# EAGLE design EMGrealPart (EAGLE 9.3.1)

## Sheet 1 of 2
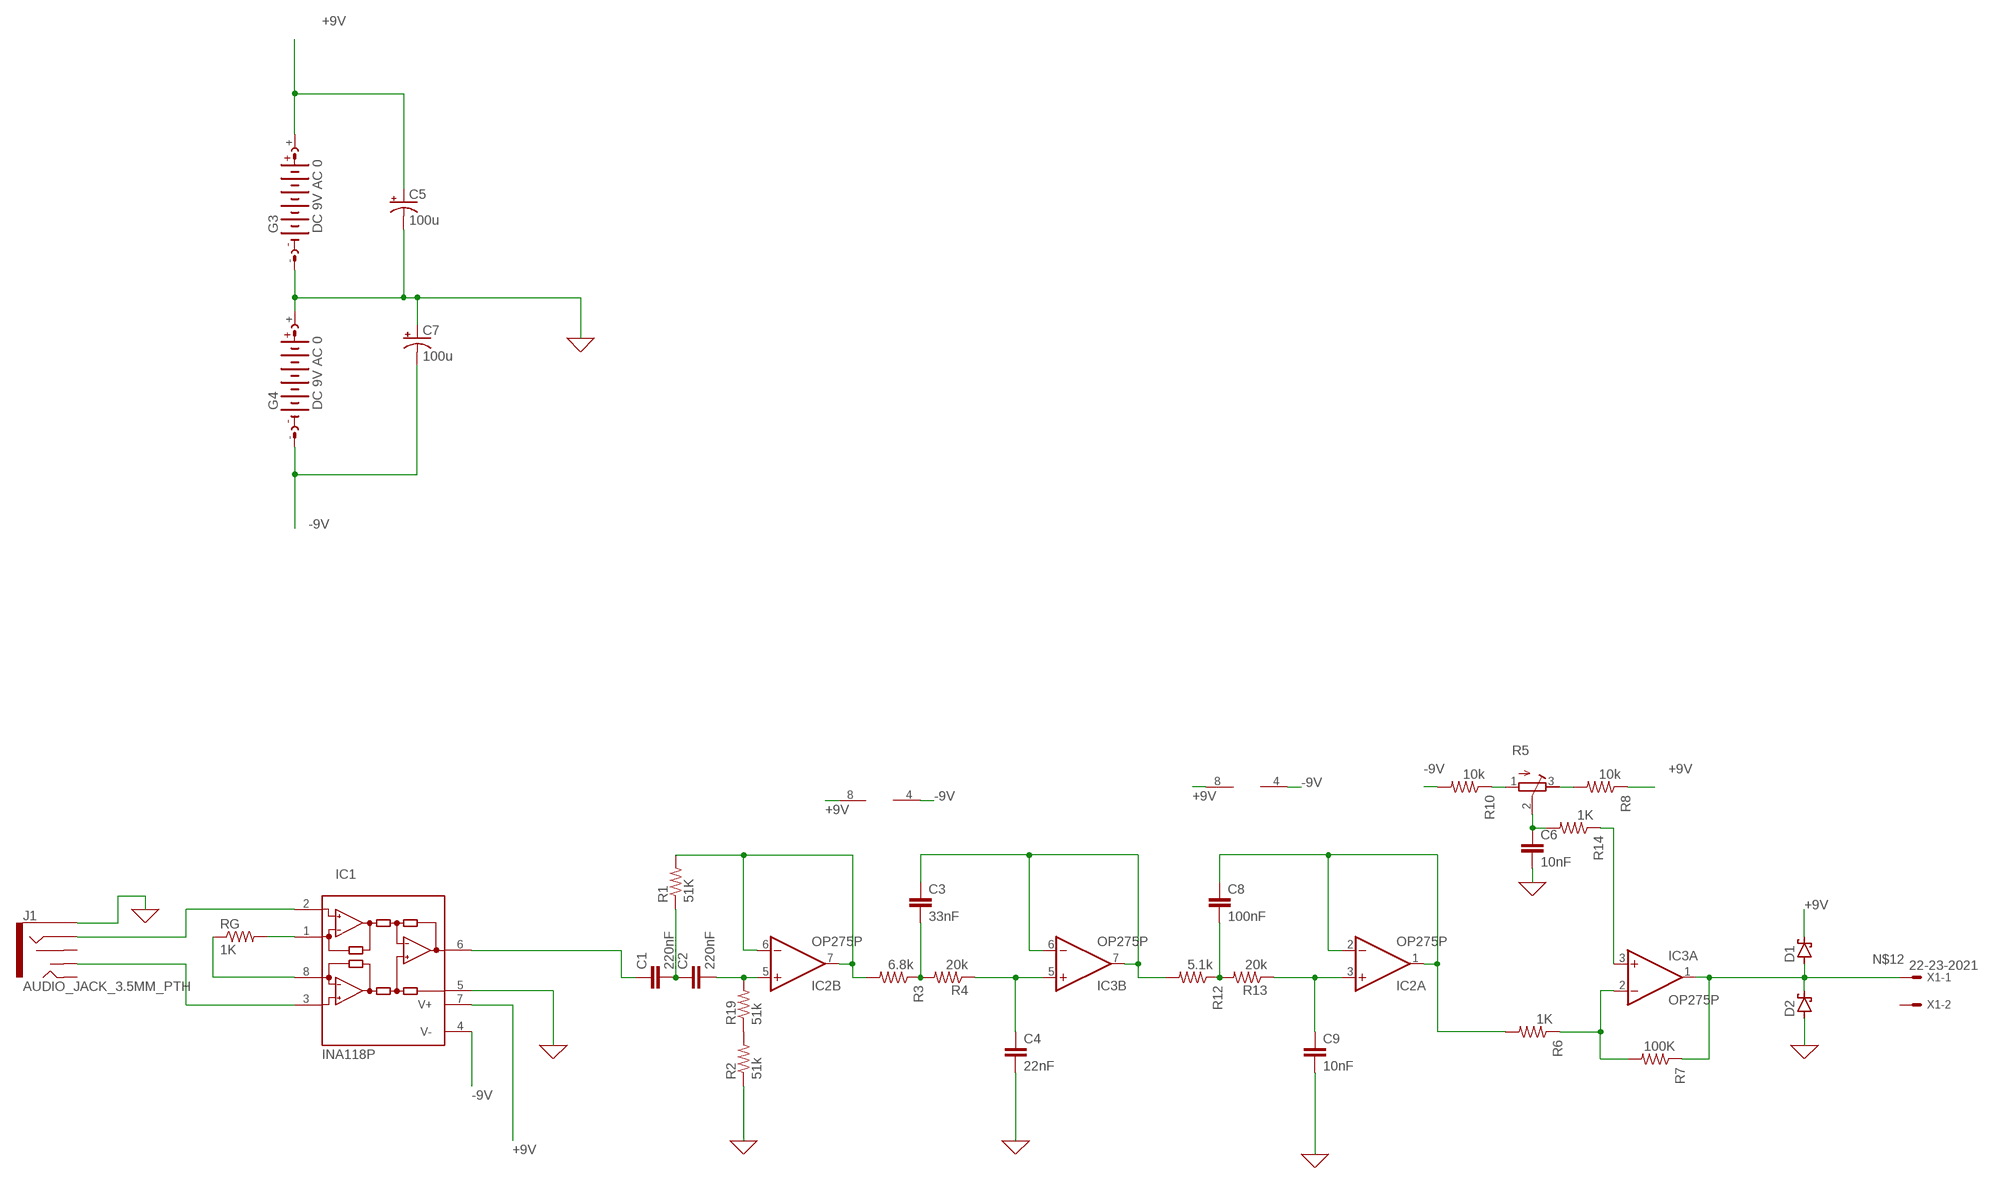
[diagram p0: schematic, sheet 1]

### Parts
C1  220nF  C-EU050-025X075  [C050-025X075]
C2  220nF  C-EU050-025X075  [C050-025X075]
C3  33nF  C-EU050-025X075  [C050-025X075]
C4  22nF  C-EU050-025X075  [C050-025X075]
C5  100u  CPOL-USE2.5-6  [E2,5-6]
C6  10nF  C-EU050-025X075  [C050-025X075]
C7  100u  CPOL-USE2.5-6  [E2,5-6]
C8  100nF  C-EU050-025X075  [C050-025X075]
C9  10nF  C-EU050-025X075  [C050-025X075]
D1  SCHOTTKY-DIODEF126Z12  [F126Z12]
D2  SCHOTTKY-DIODEF126Z12  [F126Z12]
G3  DC 9V AC 0  AB9V  [AB9V]
G4  DC 9V AC 0  AB9V  [AB9V]
IC1  INA118P  [DIL08]
IC2  OP275P  [DIL08]
IC3  OP275P  [DIL08]
J1  AUDIO_JACK_3.5MM_PTH  [AUDIO-JACK]
R1  51K  R-US_0207/12  [0207/12]
R2  51k  R-US_0207/12  [0207/12]
R3  6.8k  R-US_0207/12  [0207/12]
R4  20k  R-US_0207/12  [0207/12]
R5  R-TRIMM64W  [RTRIM64W]
R6  1K  R-US_0207/12  [0207/12]
R7  100K  R-US_0207/12  [0207/12]
R8  10k  R-US_0207/12  [0207/12]
R10  10k  R-US_0207/12  [0207/12]
R12  5.1k  R-US_0207/12  [0207/12]
R13  20k  R-US_0207/12  [0207/12]
R14  1K  R-US_0207/12  [0207/12]
R19  51k  R-US_0207/12  [0207/12]
RG  1K  R-US_0207/12  [0207/12]
X1  22-23-2021  [22-23-2021]

### Nets
0: C4.2 C5.- C6.2 C7.+ C9.2 D2.A G3.- G4.+ IC1.5(REF) J1.SLEEVE R2.1 ; supply symbol labelled GND
+9V: C5.+ D1.C G3.+ IC1.7(V+) IC2.8(P:V+) IC3.8(P:V+) R8.1
-9V: C7.- G4.- IC1.4(V-) IC2.4(P:V-) IC3.4(P:V-) R10.2
N$1: IC1.1(RG) RG.2
N$2: IC1.8(RG) RG.1
N$3: IC1.2(-IN) J1.RING
N$4: C8.2 R12.1 R13.2
N$5: C1.2 C2.1 R1.1
N$6: C1.1 IC1.6(OUT)
N$7: C2.2 IC2.5(B:+IN) R19.2
N$8: IC2.6(B:-IN) IC2.7(B:OUT) R1.2 R3.2
N$9: C3.2 R3.1 R4.2
N$10: C4.1 IC3.5(B:+IN) R4.1
N$11: C3.1 IC3.6(B:-IN) IC3.7(B:OUT) R12.2
N$12: D1.A D2.C IC3.1(A:OUT) R7.1 X1.1
N$14: C9.1 IC2.3(A:+IN) R13.1
N$15: R5.1(A) R10.1
N$16: C6.1 R5.2(S) R14.2
N$17: IC3.2(A:-IN) R6.1 R7.2
N$18: R2.2 R19.1
N$19: C8.1 IC2.1(A:OUT) IC2.2(A:-IN) R6.2
N$20: R5.3(E) R8.2
N$25: IC3.3(A:+IN) R14.1
N$26: IC1.3(+IN) J1.TSH
Unconnected: J1.RSH J1.TIP X1.2

## Sheet 2 of 2
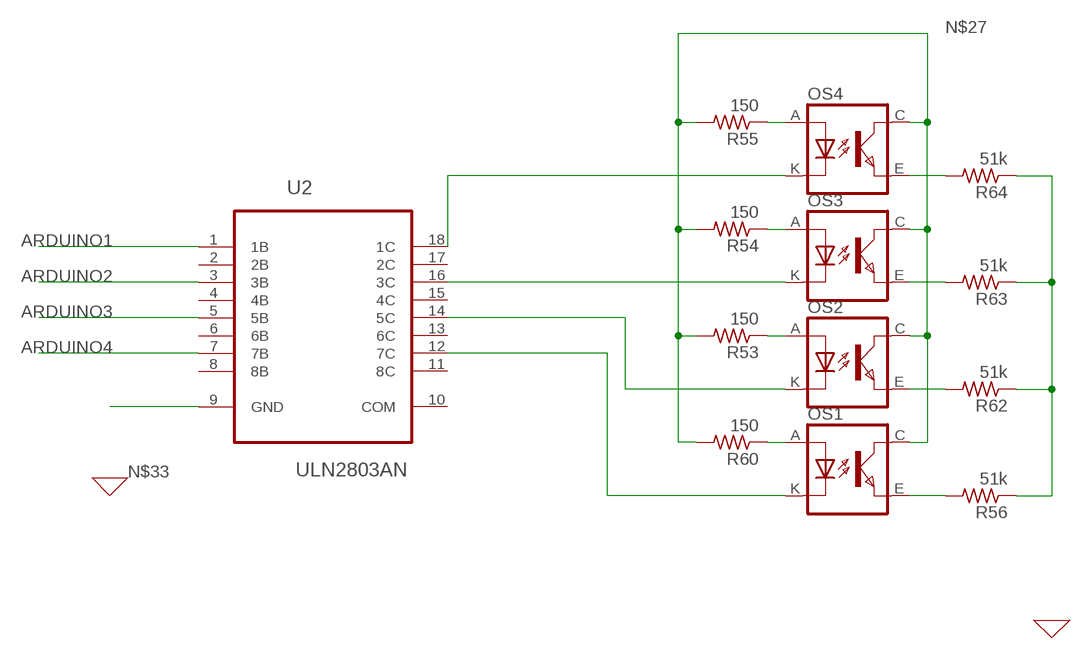
[diagram p1: schematic, sheet 2]

### Parts
OS1  TCRT5000  [TCRT5000]
OS2  TCRT5000  [TCRT5000]
OS3  TCRT5000  [TCRT5000]
OS4  TCRT5000  [TCRT5000]
R53  150  R-US_0207/12  [0207/12]
R54  150  R-US_0207/12  [0207/12]
R55  150  R-US_0207/12  [0207/12]
R56  51k  R-US_0207/12  [0207/12]
R60  150  R-US_0207/12  [0207/12]
R62  51k  R-US_0207/12  [0207/12]
R63  51k  R-US_0207/12  [0207/12]
R64  51k  R-US_0207/12  [0207/12]
U2  ULN2803AN  [DIP254P762X393-18]

### Nets
ARDUINO1: U2.1(1B)
ARDUINO2: U2.3(3B)
ARDUINO3: U2.5(5B)
ARDUINO4: U2.7(7B)
N$21: OS4.K(CATHODE) U2.18(1C)
N$22: OS3.K(CATHODE) U2.16(3C)
N$23: OS2.K(CATHODE) U2.14(5C)
N$24: OS1.K(CATHODE) U2.12(7C)
N$27: OS1.C(COLLECTOR) OS2.C(COLLECTOR) OS3.C(COLLECTOR) OS4.C(COLLECTOR) R53.2 R54.2 R55.2 R60.2
N$28: R56.1 R62.1 R63.1 R64.1
N$33: U2.9(GND)
N$94: OS1.E(EMITTER) R56.2
N$95: OS2.E(EMITTER) R62.2
N$96: OS3.E(EMITTER) R63.2
N$97: OS4.E(EMITTER) R64.2
N$98: OS4.A(ANODE) R55.1
N$99: OS3.A(ANODE) R54.1
N$100: OS2.A(ANODE) R53.1
N$101: OS1.A(ANODE) R60.1
Unconnected: U2.2(2B) U2.4(4B) U2.6(6B) U2.8(8B) U2.10(COM) U2.11(8C) U2.13(6C) U2.15(4C) U2.17(2C)

## Library data of the parts
C1-C4 C6 C8 C9 = rcl:C-EU: CAPACITOR, European symbol; SPICEPREFIX: C
C5 C7 = rcl:CPOL-US: POLARIZED CAPACITOR, American symbol; SPICEPREFIX: C
D1 D2 = diode:SCHOTTKY-DIODE: Schottky Diode
G3 G4 = battery:AB9V: 9-V BATTERY CLIP; SPICEPREFIX: V
IC1 = burr-brown:INA118: Instrumentation Amplifier Precision, Low Power; MF: TEXAS INSTRUMENTS; MPN: INA118P; OC_FARNELL: 1470354; OC_NEWARK: 96K4515; SPICEMODEL: INA118a; SPICEPREFIX: X
IC2 IC3 = linear:OP275: Dual Very Low Noise Precision Operational Amplifier Source: http://www.analog.com/static/imported-files/data_sheets/OP270.pdf; SPICEMODEL: OP275p; SPICEPREFIX: X
J1 = SparkFun-Connectors:AUDIO_JACK_3.5MM: Audio Jack 3.5mm variants of PTH and SMT stereo audio jack with bypass switches. SparkFun Products: SparkFun SparkPunk Sound Kit <[https://www.sparkfun.com/products/11177]> - PTH MP3 Trigger <https://www.sparkfun.com/products/13720> -3.5mm SMD SparkFun PicoBoard <https://www.sparkfun.com/products/11888>- 2.5mm SMD; PROD_ID: CONN-08774; SF_ID: PRT-08032
OS1-OS4 = tcrt5000:TCRT5000
R1-R4 R6-R8 R10 R12-R14 R19 R53-R56 R60 R62-R64 RG = rcl:R-US_: RESISTOR, American symbol; SPICEPREFIX: R
R5 = rcl:R-TRIMM: Trimm resistor; SPICEMODEL: X; SPICEPREFIXL: POT
U2 = transistor-arrays:ULN2803AN: Darlington transistor array; MPN: ULN2803AN; OC_FARNELL: 1652422; OC_NEWARK: 21J9298; PACKAGE: DIP-18; SUPPLIER: TEXAS INSTRUMENTS
X1 = con-molex:22-23-2021: .100" (2.54mm) Center Header - 2 Pin; MF: MOLEX; MPN: 22-23-2021; OC_FARNELL: 1462926; OC_NEWARK: 25C3832

## Module MO
Ports: OUT(io) IN(io)

### Library data of the parts

## Board
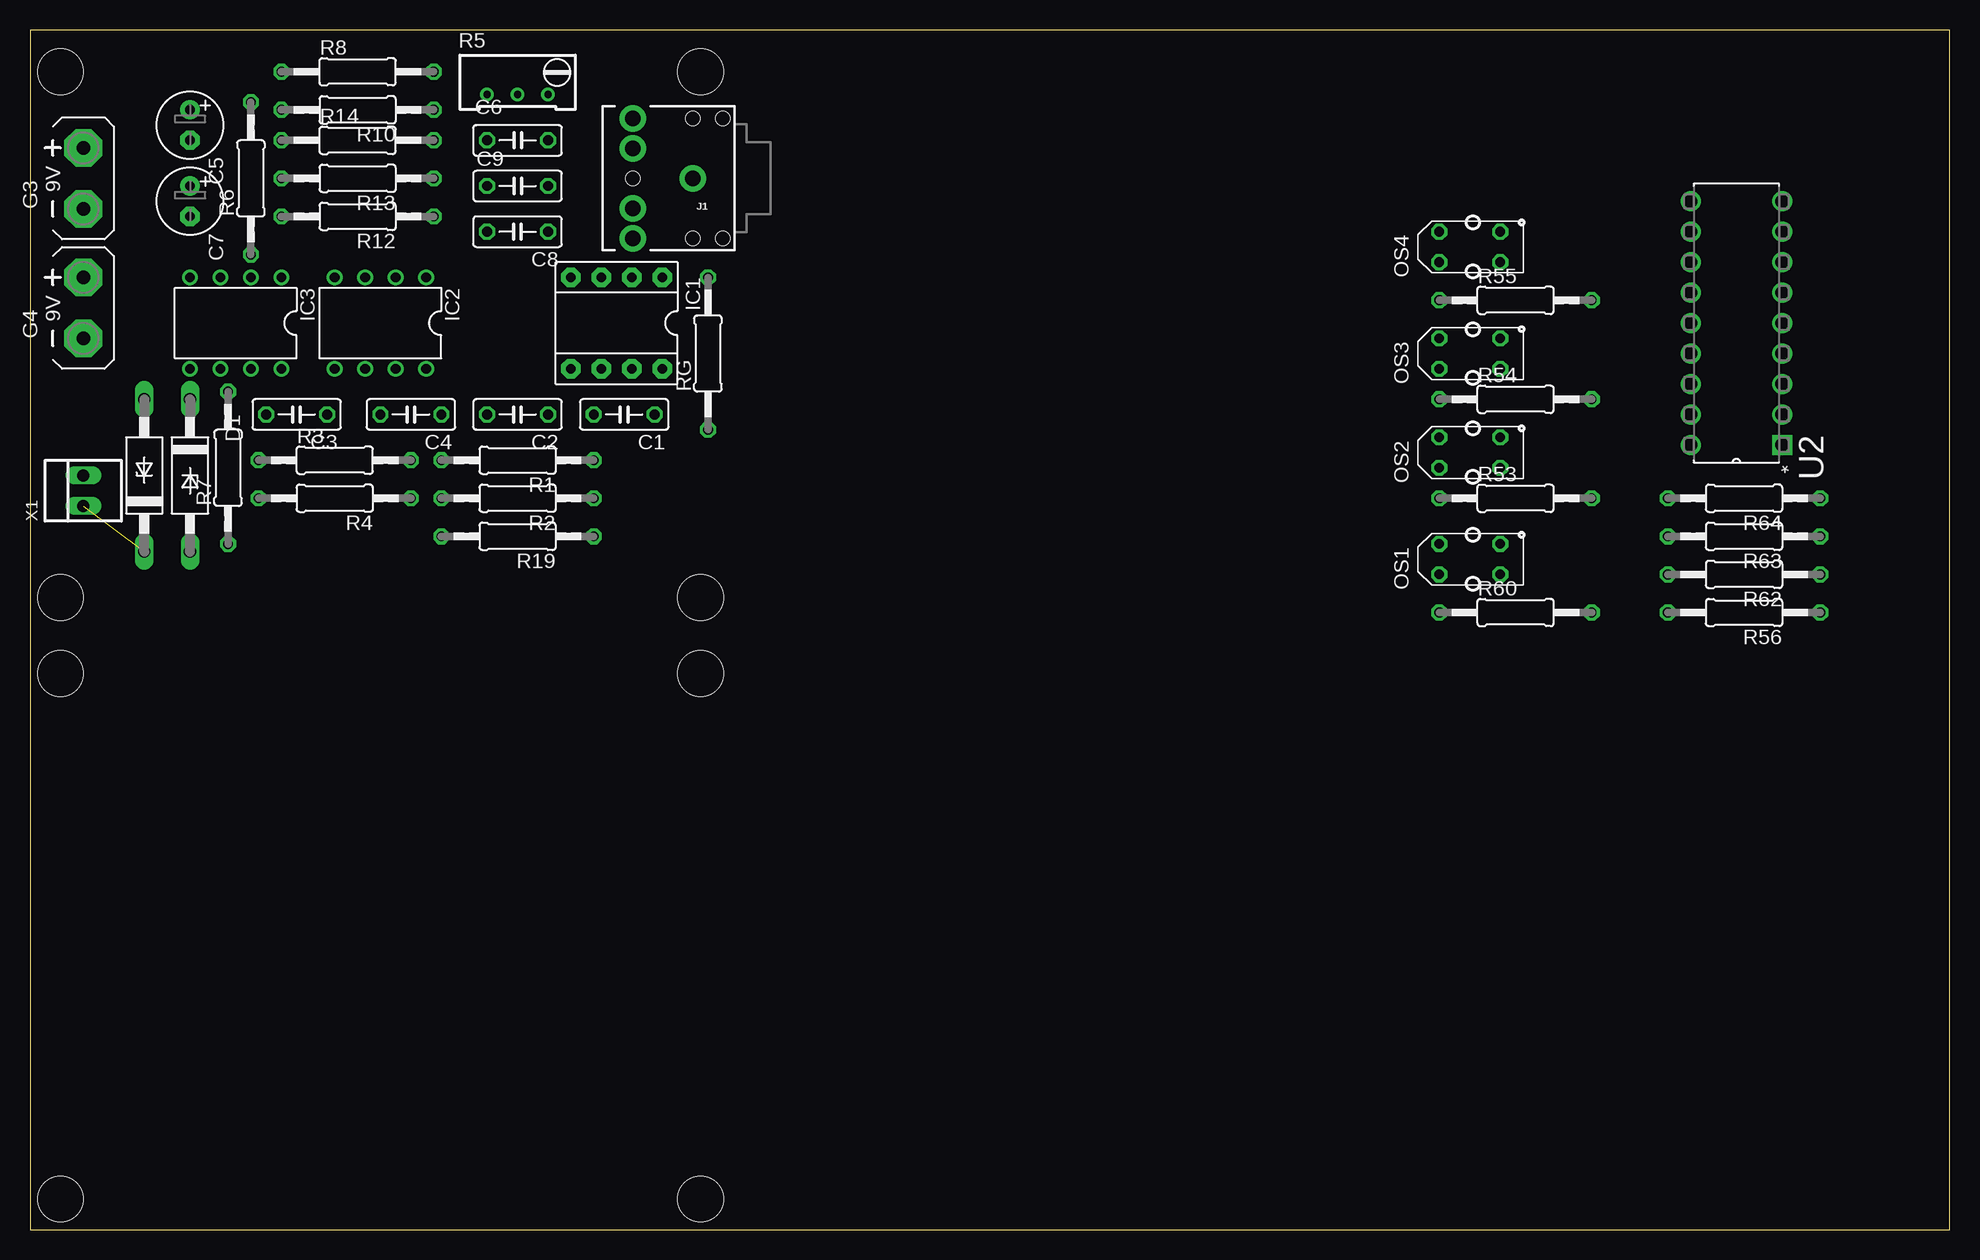
[diagram p2: board, top side]
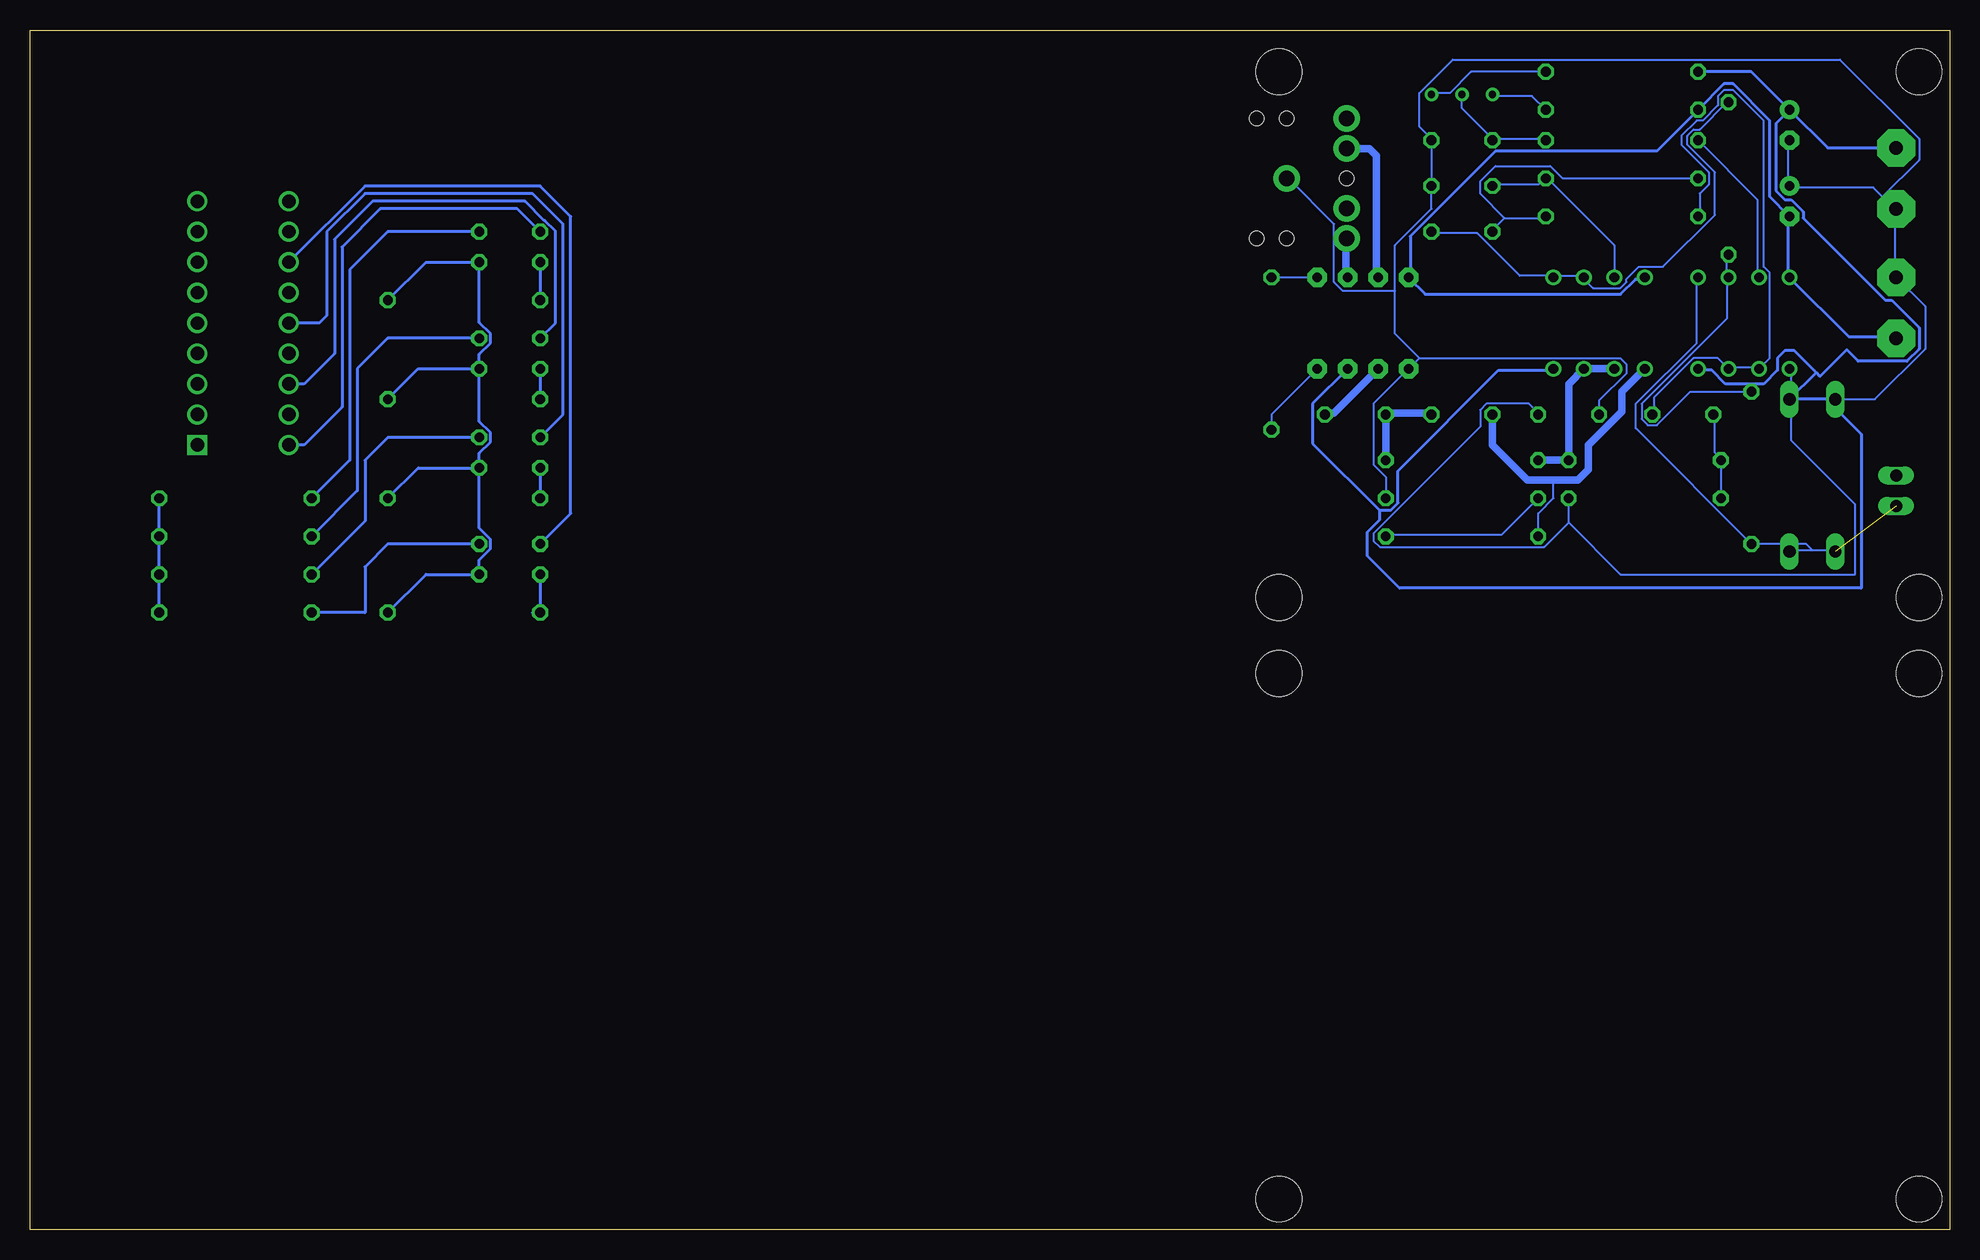
[diagram p3: board, bottom side, seen from below]

Size 160 x 100 mm. Coordinates in mm from the lower left corner, seen from the top.
Outline: 0,0 160,0 160,100 0,100 0,0
Copper layers (1*16): Top 0.035mm / dielectric 1.5mm / Bottom 0.035mm
Design rules "default": minimum track width 6mil, minimum drill 0.35mm, track to track 6mil, track to pad 6mil, pad to pad 6mil, via to via 6mil, smd to smd 6mil, copper to edge 40mil, drill to drill 6mil, minimum pad ring 10mil, minimum via ring 8mil, stop-mask expansion 4mil, vias tented up to drill 0mil, thermal gap 10mil
Holes 3.81 mm at 2.54,96.52 2.54,52.7 55.88,52.7 55.88,96.52 2.54,46.35 2.54,2.54 55.88,2.54 55.88,46.35

### Footprints (pad centres in the part's own frame; a part is rotated, then mirrored left to right if it is on the bottom)
C050-025X075 = drill 0.813 octagon: 1 -2.54,0; 2 2.54,0
E2,5-6 = drill 0.813 pad 1.6: + -1.27,0 | drill 0.813 pad 1.6 octagon: - 1.27,0
F126Z12 = drill 1.016 long: A 6.35,0; C -6.35,0
AB9V = drill 1.118 pad 3.15 octagon: + 0,2.54; - 0,-2.54
DIL08 = drill 0.813 pad 1.6 octagon: 1 -3.81,-3.81; 2 -1.27,-3.81; 3 1.27,-3.81; 4 3.81,-3.81; 5 3.81,3.81; 6 1.27,3.81; 7 -1.27,3.81; 8 -3.81,3.81
DIL08' = drill 0.813 pad 1.27: 1 -3.81,-3.81; 2 -1.27,-3.81; 3 1.27,-3.81; 4 3.81,-3.81; 5 3.81,3.81; 6 1.27,3.81; 7 -1.27,3.81; 8 -3.81,3.81
AUDIO-JACK = drill 1.3 pad 2.184: RING 5,5; RSH 5,2.5; SLEEVE 0,0; TIP 5,-5; TSH 5,-2.5 | hole 1.2: 0,5; -2.5,5; -2.5,-5; 0,-5; 5,0
TCRT5000 = drill 0.8 octagon: A -2.54,-1.27; C 2.54,-1.27; E 2.54,1.27; K -2.54,1.27
0207/12 = drill 0.813 octagon: 1 -6.35,0; 2 6.35,0
RTRIM64W = drill 0.61: 1 1.27,-2.54; 2 1.27,0; 3 1.27,2.54
DIP254P762X393-18 = drill 1.118 square: 1 -7.62,20.32 | drill 1.118: 2 -7.62,17.78; 3 -7.62,15.24; 4 -7.62,12.7; 5 -7.62,10.16; 6 -7.62,7.62; 7 -7.62,5.08; 8 -7.62,2.54; 9 -7.62,0; 10 0,0; 11 0,2.54; 12 0,5.08; 13 0,7.62; 14 0,10.16; 15 0,12.7; 16 0,15.24; 17 0,17.78; 18 0,20.32
22-23-2021 = drill 1 long: 1 -1.27,0; 2 1.27,0

### Placement (x,y rotation side)
C1  49.53,67.94 180 top
C2  40.64,67.94 180 top
C3  22.23,67.94 180 top
C4  31.75,67.94 180 top
C5  13.34,92.08 270 top
C6  40.64,90.81 0 top
C7  13.34,85.72 270 top
C8  40.64,83.19 180 top
C9  40.64,87 0 top
D1  13.34,62.87 270 top
D2  9.53,62.87 90 top
G3  4.45,87.63 0 top
G4  4.45,76.83 0 top
IC1  48.9,75.56 180 top
IC2  OP275P  [DIL08']  29.21,75.56 180 top
IC3  OP275P  [DIL08']  17.14,75.56 180 top
J1  55.24,87.63 180 top
OS1  120.02,55.88 0 top
OS2  120.02,64.77 0 top
OS3  120.02,73.03 0 top
OS4  120.02,81.92 0 top
R1  40.64,64.14 180 top
R2  40.64,60.96 180 top
R3  25.4,64.14 0 top
R4  25.4,60.96 180 top
R5  40.64,95.89 270 top
R6  18.41,87.63 90 top
R7  16.51,63.5 90 top
R8  27.3,96.52 0 top
R10  27.3,93.34 180 top
R12  27.3,84.45 180 top
R13  27.3,87.63 180 top
R14  27.3,90.81 0 top
R19  40.64,57.78 180 top
R53  123.83,60.96 0 top
R54  123.83,69.22 0 top
R55  123.83,77.47 0 top
R56  142.88,51.44 180 top
R60  123.83,51.44 0 top
R62  142.88,54.61 180 top
R63  142.88,57.78 180 top
R64  142.88,60.96 180 top
RG  56.52,73.03 90 top
U2  138.43,85.72 180 top
X1  4.45,61.59 90 top

### Tracks (layer width: path | path; a pad name or v marks a point on that pad's centre or on a via)
0
  Bottom 0.152: D2.A 6.22,69.22 2.03,73.41 2.03,76.96 G4.+ 4.57,79.5 4.57,85.09 | C5.- 13.46,90.68 13.46,87.12 C7.+ 13.21,86.87 6.35,86.87 5.59,86.11 | 4.57,85.09 5.59,86.11 | 4.57,85.09 G3.- 5.59,86.11 | C4.2 29.21,69.09 26.92,71.37 26.92,72.14 27.43,72.64 44.2,72.64 | 44.2,72.64 IC1.5 48.01,68.83 48.01,63.75 46.99,62.74 R2.1 | 46.23,78.23 46.23,74.68 44.2,72.64 | 46.23,78.23 46.23,82.04 43.18,85.09 C9.2 C6.2 43.18,90.93 44.2,91.95 44.2,94.74 41.4,97.54 9.14,97.54 2.54,90.93 2.54,89.15 5.59,86.11 | 46.23,78.23 50.55,78.23 51.31,78.99 51.31,83.82 55.12,87.63 J1.SLEEVE
+9V
  Bottom 0.254: 47.5,59.94 53.09,65.53 53.09,68.83 IC1.7 | IC2.8 33.02,71.63 37.59,71.63 45.97,63.25 45.97,60.58 46.61,59.94 47.5,59.94 | 11.11,71.44 10.79,71.12 8.57,73.34 7.62,72.39 3.56,72.39 2.54,73.41 2.54,75.18 4.83,77.47 5.33,77.47 12.19,84.33 12.19,84.84 13.21,85.85 13.72,85.85 14.48,86.61 14.48,92.2 C5.+ | 11.11,71.44 12.95,73.28 13.72,73.28 14.35,72.64 14.35,71.63 15.49,70.48 18.67,70.48 19.81,71.63 20.83,71.63 IC3.8 | R8.1 16.51,96.52 C5.+ | G3.+ 10.16,90.17 C5.+ | 47.5,59.94 47.5,59.18 48.51,58.17 48.51,56.13 45.85,53.47 7.37,53.47 7.37,66.29 10.29,69.22 D1.C 11.11,71.44
-9V
  Bottom 0.254: IC2.4 25.4,79.25 26.16,79.25 27.43,77.98 43.69,77.98 IC1.4 44.96,79.5 44.96,82.8 37.85,89.92 24.38,89.92 R10.2 18.8,95.5 18.03,95.5 14.99,92.46 14.99,86.11 C7.- 13.46,84.33 13.46,79.5 IC3.4 8.38,74.42 4.57,74.42 G4.-
N$1
  Bottom 0.152: IC1.1 RG.2
N$2
  Bottom 0.152: RG.1 56.52,67.94 IC1.8
N$3
  Bottom 0.152: 50.29,79.5 IC1.2 | 50.29,82.55 J1.RING
  Bottom 0.61: 50.29,82.55 50.29,79.5
N$4
  Bottom 0.152: 37.08,84.33 33.78,84.33 R12.1 | 37.08,84.33 38.1,83.31 C8.2 | R13.2 32.26,87.63 33.27,88.65 37.85,88.65 39.12,87.38 39.12,86.36 37.08,84.33
N$5
  Bottom 0.152: 43.18,68.07 C2.1 | 46.99,68.07 C1.2
  Bottom 0.61: 46.99,68.07 43.18,68.07 | C1.2 R1.1
N$6
  Bottom 0.61: IC1.6 51.31,68.07 52.07,68.07 C1.1
N$7
  Bottom 0.152: R19.2 34.29,59.69 33.02,60.96 33.02,62.48
  Bottom 0.61: IC2.5 27.3,69.85 27.3,68.2 30.1,65.41 30.1,63.37 30.99,62.48 33.02,62.48 35.18,62.48 38.1,65.41 C2.2
N$8
  Bottom 0.61: IC2.6 IC2.7 31.75,70.48 R3.2 R1.2
N$9
  Bottom 0.152: R4.2 R3.1 19.05,64.26 19.56,64.77 19.56,67.82 C3.2
N$10
  Bottom 0.152: 31.75,58.93 R4.1 | 31.75,58.93 33.78,56.9 47.5,56.9 48.01,57.4 48.01,58.04 39.12,66.93 39.12,68.33 38.61,68.83 35.05,68.83 34.29,68.07 C4.1 | 31.75,58.93 27.43,54.61 7.87,54.61 7.87,60.45 13.21,65.79 13.21,71.63 IC3.5
N$11
  Bottom 0.152: C3.1 24.64,68.07 24.64,69.34 21.34,72.64 19.3,72.64 IC3.7 18.29,71.88 16,71.88 IC3.6 14.99,72.64 14.99,79.76 15.49,80.26 15.49,92.46 18.03,95 18.8,95 19.3,94.49 19.3,93.73 20.57,92.46 21.08,92.46 22.35,91.19 22.35,90.42 20.07,88.14 20.07,87.12 20.83,86.36 20.83,84.58 R12.2
N$12  (1 unrouted)
  Bottom 0.152: 11.43,56.64 11.94,57.15 R7.1 26.16,66.8 26.16,68.83 21.08,73.91 21.08,79.25 IC3.1 | 11.43,56.64 13.34,56.64 D1.A | 11.43,56.64 9.53,56.64 D2.C
N$14
  Bottom 0.152: IC2.3 27.94,82.04 33.53,87.63 R13.1 33.78,87.63 34.29,87.12 38.1,87.12 C9.1
N$15
  Bottom 0.152: R10.1 34.8,94.49 38.1,94.49 R5.1
N$16
  Bottom 0.152: R5.2 40.64,93.47 38.1,90.93 | 38.1,90.93 33.78,90.93 R14.2 | 38.1,90.93 C6.1
N$17
  Bottom 0.152: R7.2 21.59,69.85 24.38,67.06 25.15,67.06 25.65,67.56 25.65,68.83 18.54,75.95 18.54,79.25 IC3.2 18.54,79.5 18.54,81.28 R6.1
N$18
  Bottom 0.152: R2.2 37.34,57.91 46.99,57.91 R19.1
N$19
  Bottom 0.152: 33.02,79.5 30.48,79.5 IC2.2 30.48,79.25 29.72,78.49 27.43,78.49 26.92,78.99 26.92,79.25 25.91,80.26 23.88,80.26 19.56,84.58 19.56,88.14 21.84,90.42 21.84,91.19 21.34,91.69 20.83,91.69 18.54,93.98 R6.2 | 33.02,79.5 35.81,79.5 39.37,83.06 43.18,83.06 C8.1 | 33.02,79.5 IC2.1
N$20
  Bottom 0.152: R8.2 39.88,96.52 41.66,94.74 43.18,94.74 R5.3
N$21
  Bottom 0.254: OS4.K 119.38,85.09 130.81,85.09 133.99,81.92 133.99,68.58 137.16,65.41 U2.18
N$22
  Bottom 0.254: OS3.K 116.2,75.56 116.2,83.23 117.09,84.12 117.14,84.12 118.75,85.72 131.44,85.72 134.62,82.55 134.62,73.03 137.16,70.48 U2.16
N$23
  Bottom 0.254: OS2.K 115.57,67.94 115.57,83.82 118.11,86.36 132.08,86.36 135.25,83.19 135.25,76.2 135.89,75.56 U2.14
N$24
  Bottom 0.254: OS1.K 114.94,59.69 114.94,84.45 117.47,87 132.08,87 U2.12
N$25
  Bottom 0.152: R14.1 16,85.85 16,79.5 IC3.3
N$26
  Bottom 0.152: 47.75,79.5 IC1.3
  Bottom 0.61: 47.75,79.5 47.75,89.53 48.34,90.12 J1.TSH
N$27
  Bottom 0.254: R60.2 127,54.61 OS1.C 122.56,55.83 121.62,56.76 121.62,57.54 122.56,58.47 OS2.C | R53.2 127.64,63.5 OS2.C | R54.2 127.64,71.75 OS3.C | R55.2 127,80.64 OS4.C 122.56,75.61 121.62,74.68 121.62,73.91 122.56,72.97 OS3.C | OS2.C 122.56,64.72 121.62,65.65 121.62,66.43 122.56,67.36 OS3.C
N$28
  Bottom 0.254: R56.1 R62.1 R63.1 R64.1
N$94
  Bottom 0.254: R56.2 132.08,51.44 132.08,55.24 130.18,57.15 OS1.E
N$95
  Bottom 0.254: OS2.E 130.18,66.04 132.08,64.14 132.08,59.05 R62.2
N$96
  Bottom 0.254: OS3.E 130.18,74.3 132.72,71.75 132.72,61.59 R63.2
N$97
  Bottom 0.254: OS4.E 130.18,83.19 133.35,80.01 133.35,64.14 R64.2
N$98
  Bottom 0.254: OS4.A R55.1
N$99
  Bottom 0.254: OS3.A R54.1
N$100
  Bottom 0.254: OS2.A R53.1
N$101
  Bottom 0.152: 117.82,51.73 117.6,51.51 R60.1
  Bottom 0.254: OS1.A 117.47,52.07 117.82,51.73 118.11,51.44